# EAGLE design amphenol_npa201 (EAGLE 8.2.2)
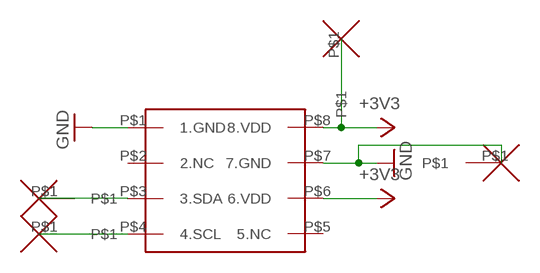
[diagram p0: schematic, sheet 1]

## Parts
U$1  AMPHENOL_NPA201  [AMPHENOL_NPA201]
U$2  WIREPAD_0,8/0,45  [WIREPAD_0,8/0,45]
U$3  WIREPAD_0,8/0,45  [WIREPAD_0,8/0,45]
U$4  WIREPAD_0,8/0,45  [WIREPAD_0,8/0,45]
U$5  WIREPAD_0,8/0,45  [WIREPAD_0,8/0,45]

## Nets
+3V3: U$1.P$6(6.VDD) U$1.P$8(8.VDD) U$4.P$1
GND: U$1.P$1(1.GND) U$1.P$7(7.GND) U$5.P$1
N$1: U$1.P$3(3.SDA) U$2.P$1
N$2: U$1.P$4(4.SCL) U$3.P$1
Unconnected: U$1.P$2(2.NC) U$1.P$5(5.NC)

## Library data of the parts
U$1 = Amphenol_NPA201:AMPHENOL_NPA201
U$2-U$5 = wirepad_08-045:WIREPAD_0,8/0,45

## Board
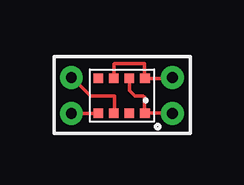
[diagram p1: board, top side]

No outline drawn. Coordinates in mm, seen from the top.
Copper layers (1*16): Top 0.035mm / dielectric 1.5mm / Bottom 0.035mm
Design rules "default": minimum track width 6mil, minimum drill 0.35mm, track to track 6mil, track to pad 6mil, pad to pad 6mil, via to via 6mil, smd to smd 6mil, copper to edge 40mil, drill to drill 6mil, minimum pad ring 10mil, minimum via ring 8mil, stop-mask expansion 4mil, vias tented up to drill 0mil, thermal gap 10mil

### Footprints (pad centres in the part's own frame; a part is rotated, then mirrored left to right if it is on the bottom)
AMPHENOL_NPA201 = smd 0.4 x 0.4: P$1 0.975,-0.725; P$2 0.325,-0.725; P$3 -0.325,-0.725; P$4 -0.975,-0.725; P$5 -0.975,0.725; P$6 -0.325,0.725; P$7 0.325,0.725; P$8 0.975,0.725
WIREPAD_0,8/0,45 = drill 0.45 pad 0.71: P$1 0,0

### Placement (x,y rotation side)
U$1  2.85,1.6 0 top
U$2  0.75,2.36 0 top
U$3  0.75,0.86 0 top
U$4  4.97,2.36 0 top
U$5  4.97,0.86 0 top

### Tracks (layer width: path | path; a pad name or v marks a point on that pad's centre or on a via)
+3V3
  Top 0.152: U$1.P$6 2.52,2.92 2.55,2.95 3.8,2.95 3.8,2.35 U$1.P$8 4.93,2.33 U$4.P$1
GND
  Top 0.152: U$1.P$7 3.17,1.82 3.4,1.6 3.75,1.6 3.8,1.55 3.8,0.9 U$1.P$1 4.95,0.88 U$5.P$1
N$1
  Top 0.152: U$2.P$1 0.79,2.36 1.55,1.6 2.55,1.6 2.55,0.9 U$1.P$3
N$2
  Top 0.152: U$3.P$1 1.86,0.86 U$1.P$4